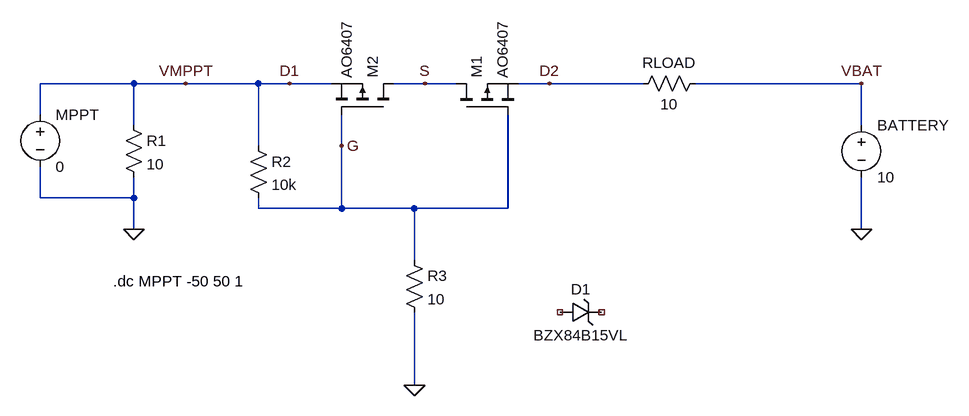
[diagram p0: schematic OutputReversePolarityProtectionBackToBack.asc]
OutputReversePolarityProtectionBackToBack.asc, the LTspice schematic file:
Version 4
SHEET 1 880 680
WIRE -384 112 -528 112
WIRE -304 112 -384 112
WIRE -192 112 -304 112
WIRE -144 112 -192 112
WIRE -80 112 -144 112
WIRE 64 112 16 112
WIRE 112 112 64 112
WIRE 256 112 208 112
WIRE 400 112 256 112
WIRE 736 112 480 112
WIRE -528 160 -528 112
WIRE -384 176 -384 112
WIRE 736 176 736 112
WIRE -192 208 -192 112
WIRE -64 208 -64 160
WIRE -528 288 -528 240
WIRE -384 288 -384 256
WIRE -384 288 -528 288
WIRE -192 304 -192 288
WIRE -64 304 -64 208
WIRE -64 304 -192 304
WIRE 48 304 -64 304
WIRE 192 304 192 160
WIRE 192 304 48 304
WIRE -384 336 -384 288
WIRE 736 336 736 256
WIRE 48 384 48 304
WIRE 48 576 48 464
FLAG -384 336 0
FLAG 736 336 0
FLAG 48 576 0
FLAG -304 112 VMPPT
FLAG 736 112 VBAT
FLAG -64 208 G
FLAG 64 112 S
FLAG 256 112 D2
FLAG -144 112 D1
SYMBOL voltage -528 144 R0
WINDOW 123 0 0 Left 0
WINDOW 39 0 0 Left 0
SYMATTR InstName MPPT
SYMATTR Value 0
SYMBOL voltage 736 160 R0
WINDOW 123 0 0 Left 0
WINDOW 39 0 0 Left 0
SYMATTR InstName BATTERY
SYMATTR Value 10
SYMBOL res 384 128 R270
WINDOW 0 32 56 VTop 2
WINDOW 3 0 56 VBottom 2
SYMATTR InstName RLOAD
SYMATTR Value 10
SYMBOL zener 272 480 R270
WINDOW 0 36 32 VTop 2
WINDOW 3 -4 32 VBottom 2
SYMATTR InstName D1
SYMATTR Value BZX84B15VL
SYMBOL pmos 112 160 R270
SYMATTR InstName M1
SYMATTR Value AO6407
SYMBOL pmos 16 160 M270
SYMATTR InstName M2
SYMATTR Value AO6407
SYMBOL res -208 192 R0
SYMATTR InstName R2
SYMATTR Value 10k
SYMBOL res -400 160 R0
SYMATTR InstName R1
SYMATTR Value 10
SYMBOL res 32 368 R0
SYMATTR InstName R3
SYMATTR Value 10
TEXT -416 416 Left 2 !.dc MPPT -50 50 1

The netlist it stands for:
* OutputReversePolarityProtectionBackToBack.asc
V§MPPT D1 0 0
V§BATTERY VBAT 0 10
RLOAD D2 VBAT 10
D1 NC_01 NC_02 BZX84B15VL
M1 S G D2 D2 AO6407
M2 S G D1 D1 AO6407
R2 D1 G 10k
R1 D1 0 10
R3 G 0 10
.model D D
.lib standard.dio
.model NMOS NMOS
.model PMOS PMOS
.lib standard.mos
.dc MPPT -50 50 1
.backanno
.end

* Results of the author's LTspice run, read from the files saved beside the schematic
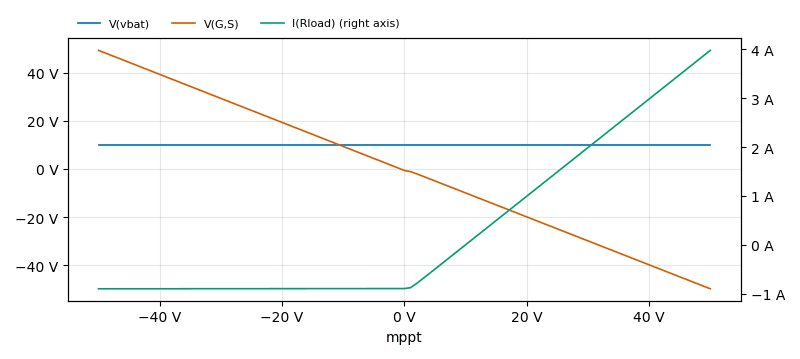
[diagram p1: DC transfer characteristic of OutputReversePolarityProtectionBackToBack.asc, plotted from the saved traces]
* DC transfer characteristic, 1 run:
*   V(vbat): 10 V at mppt=-50 V, 10 V at mppt=50 V, min 10 V, max 10 V
*   V(G,S): 49.31 V at mppt=-50 V, -49.85 V at mppt=50 V, min -49.85 V, max 49.31 V
*   I(Rload): -901.3 mA at mppt=-50 V, 3.98 A at mppt=50 V, min -901.3 mA, max 3.98 A